# EAGLE design 04B-005 (EAGLE 6.3)
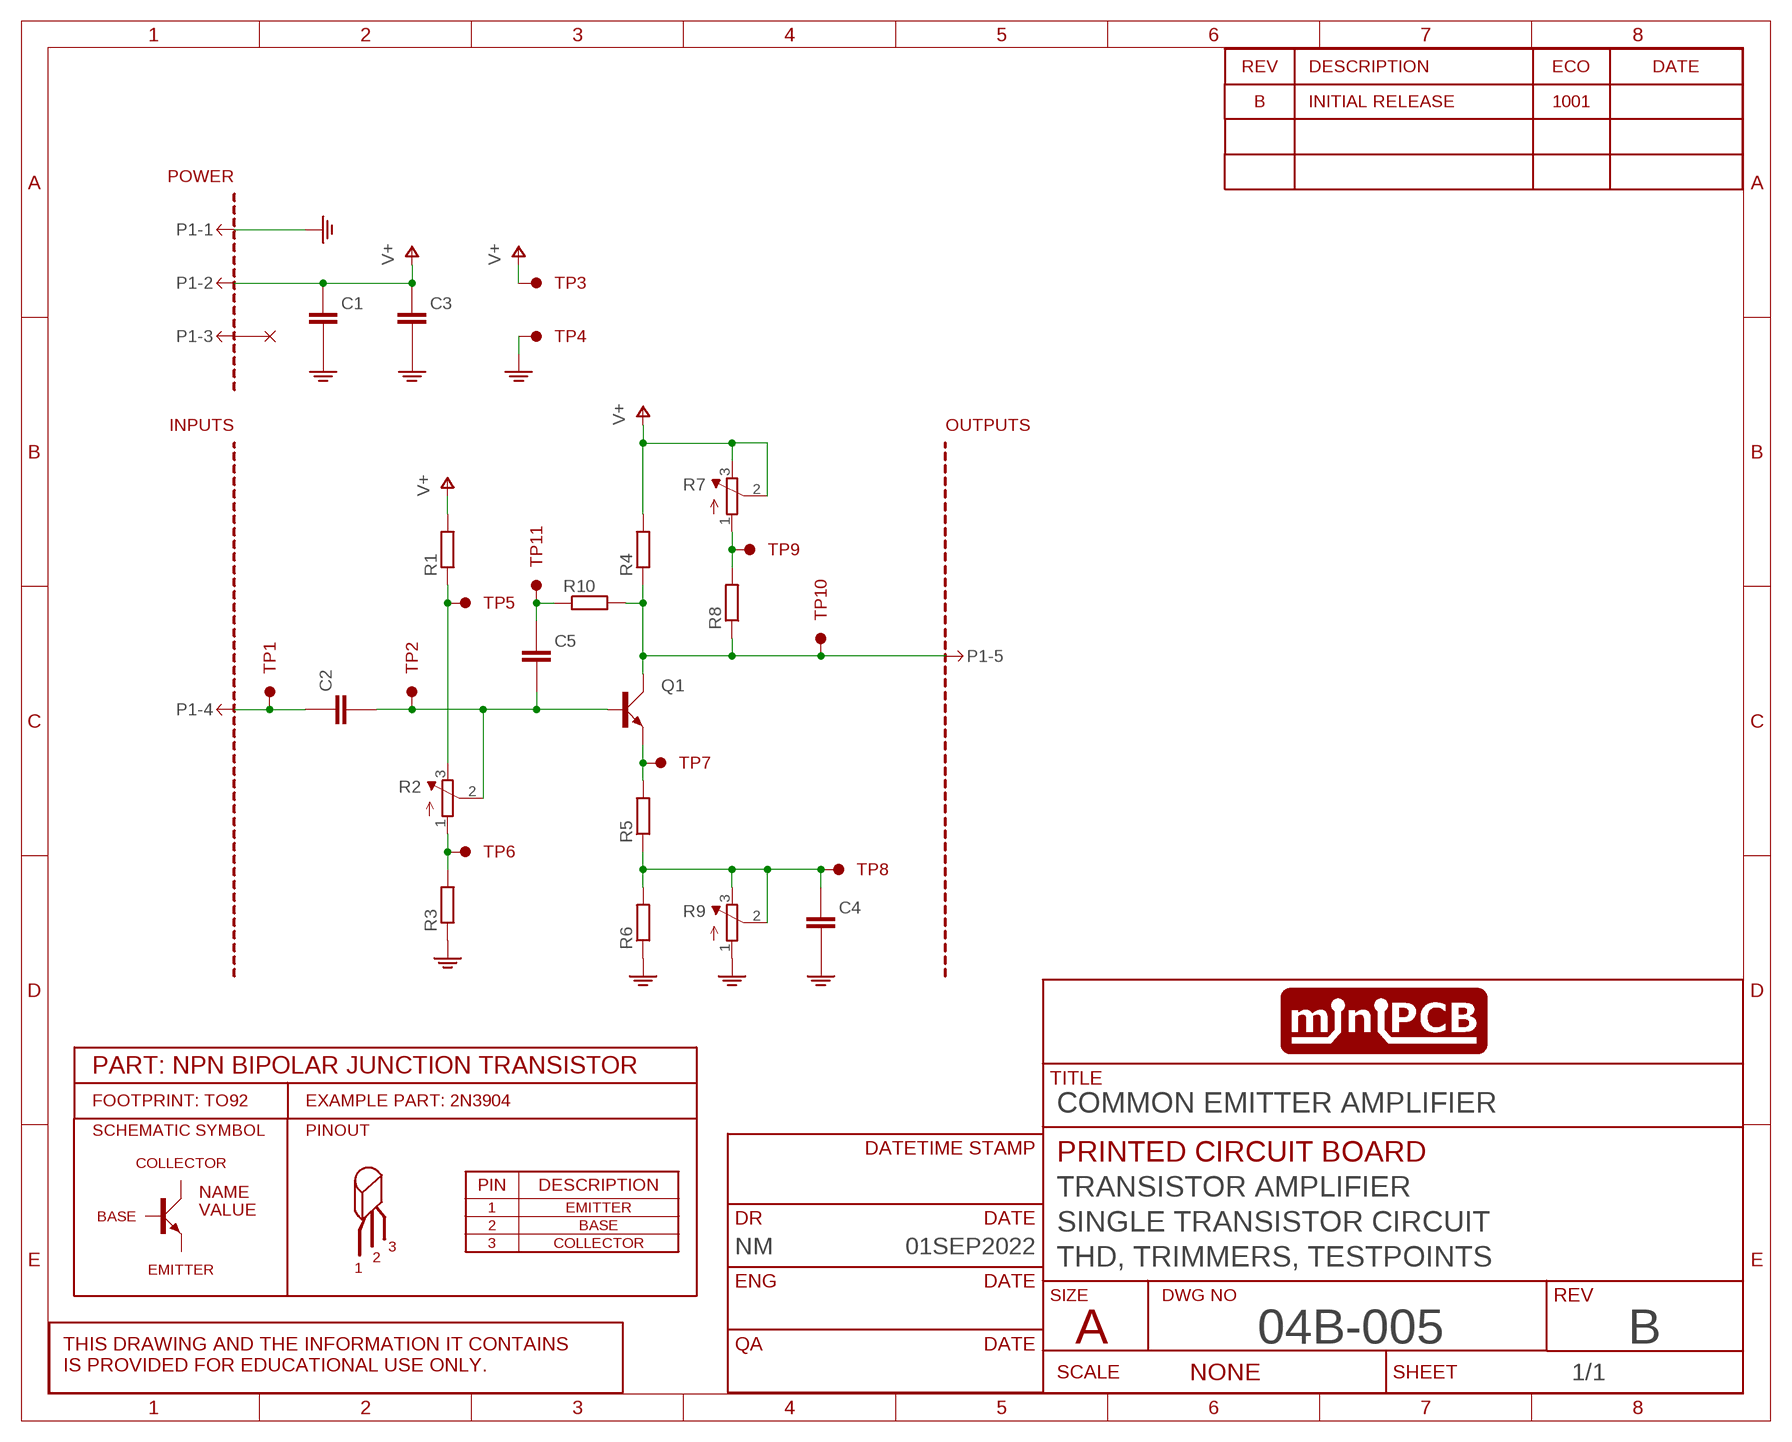
[diagram p0: schematic, sheet 1]
SHEET1 (SCHEMATIC): CIRCUIT_CATEGORY: TRANSISTOR AMPLIFIER; CIRCUIT_NAME: SINGLE TRANSISTOR CIRCUIT; CIRCUIT_VARIANT: THD, TRIMMERS, TESTPOINTS; DR: NM; DR_DATE: 01SEP2022; REVA: B; REVA_ECO: 1001; REVISION: B; TITLE: COMMON EMITTER AMPLIFIER

## Parts
C1  CAPACITORTHD  [C050-024X044]
C2  CAPACITORTHD  [C050-024X044]
C3  CAPACITORTHD  [C050-024X044]
C4  CAPACITORTHD  [C050-024X044]
C5  CAPACITORTHD  [C050-024X044]
P1-  MINIPCB_5P50X50  [MINIPCB_5P_50X50MM]
Q1  BJT_NPNEBC  [TO92-EBC-OVAL]
R1  RESISTOR10MM  [0207/10]
R2  TRIMPOT0.100THD  [TRIM_0100]
R3  RESISTOR10MM  [0207/10]
R4  RESISTOR10MM  [0207/10]
R5  RESISTOR10MM  [0207/10]
R6  RESISTOR10MM  [0207/10]
R7  TRIMPOT0.100THD  [TRIM_0100]
R8  RESISTOR10MM  [0207/10]
R9  TRIMPOT0.100THD  [TRIM_0100]
R10  RESISTOR10MM  [0207/10]
TP1  TESTPOINTKE5000-SMTEXT  [PINS_1_TESTPOINT_KE5000_NOTEXT]
TP2  TESTPOINTKE5000-SMTEXT  [PINS_1_TESTPOINT_KE5000_NOTEXT]
TP3  TESTPOINTKE5000-SMTEXT  [PINS_1_TESTPOINT_KE5000_NOTEXT]
TP4  TESTPOINTKE5000-SMTEXT  [PINS_1_TESTPOINT_KE5000_NOTEXT]
TP5  TESTPOINTKE5000-SMTEXT  [PINS_1_TESTPOINT_KE5000_NOTEXT]
TP6  TESTPOINTKE5000-SMTEXT  [PINS_1_TESTPOINT_KE5000_NOTEXT]
TP7  TESTPOINTKE5000-SMTEXT  [PINS_1_TESTPOINT_KE5000_NOTEXT]
TP8  TESTPOINTKE5000-SMTEXT  [PINS_1_TESTPOINT_KE5000_NOTEXT]
TP9  TESTPOINTKE5000-SMTEXT  [PINS_1_TESTPOINT_KE5000_NOTEXT]
TP10  TESTPOINTKE5000-SMTEXT  [PINS_1_TESTPOINT_KE5000_NOTEXT]
TP11  TESTPOINTKE5000-SMTEXT  [PINS_1_TESTPOINT_KE5000_NOTEXT]

## Nets
GND: C1.2(-) C3.2(-) C4.2(-) P1-.1 R3.1 R6.1 R9.1(A) TP4.1
N$1: R7.1(A) R8.2 TP9.1
N$2: R1.1 R2.3(E) TP5.1
N$3: R2.1(A) R3.2 TP6.1
N$4: C4.1(+) R5.1 R6.2 R9.2(S) R9.3(E) TP8.1
N$5: C2.2(-) C5.2(-) Q1.B R2.2(S) TP2.1
N$6: Q1.E R5.2 TP7.1
N$8: C5.1(+) R10.1 TP11.1
N$9: P1-.5 Q1.C R4.1 R8.1 R10.2 TP10.1
N$10: C2.1(+) P1-.4 TP1.1
V+: C1.1(+) C3.1(+) P1-.2 R1.2 R4.2 R7.2(S) R7.3(E) TP3.1
Unconnected: P1-.3

## Library data of the parts
C1-C5 = minipcb:CAPACITOR
P1- = minipcb:MINIPCB_5P; PART_NUMBER: X04B-005-B; REVISION: A
Q1 = minipcb:BJT_NPN: TRANSISTOR
R1 R3-R6 R8 R10 = minipcb:RESISTOR
R2 R7 R9 = minipcb:TRIMPOT: SMT trimmer potentiometer part number TC33X http://www.ladyada.net/library/eagle
TP1-TP11 = minipcb:TESTPOINT

## Board
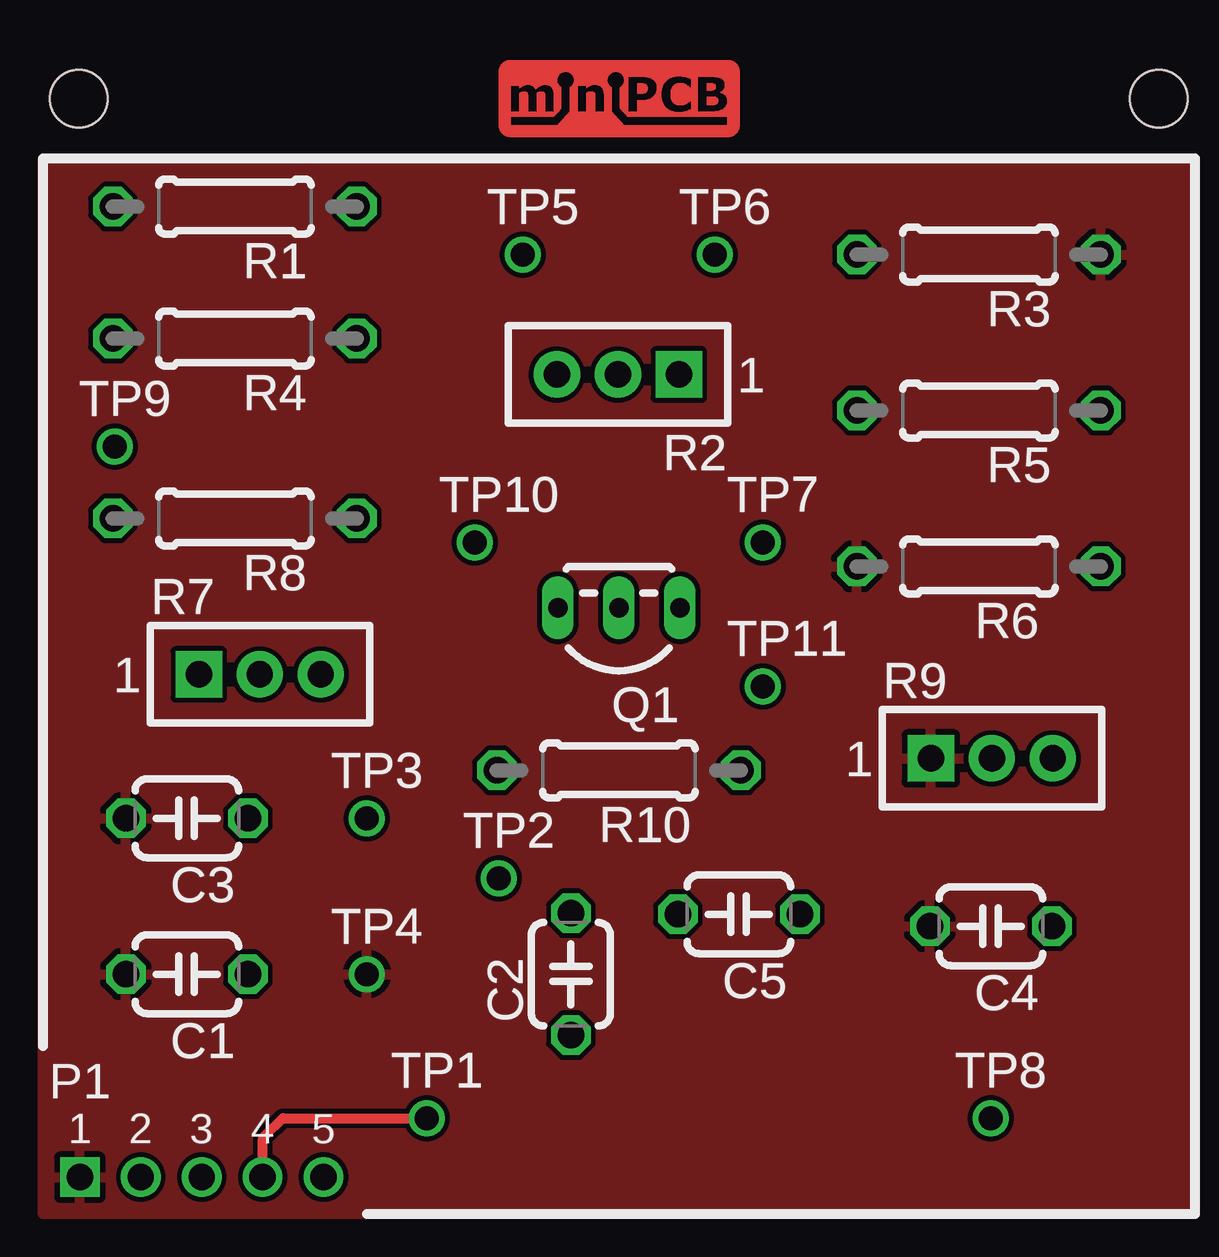
[diagram p1: board, top side]
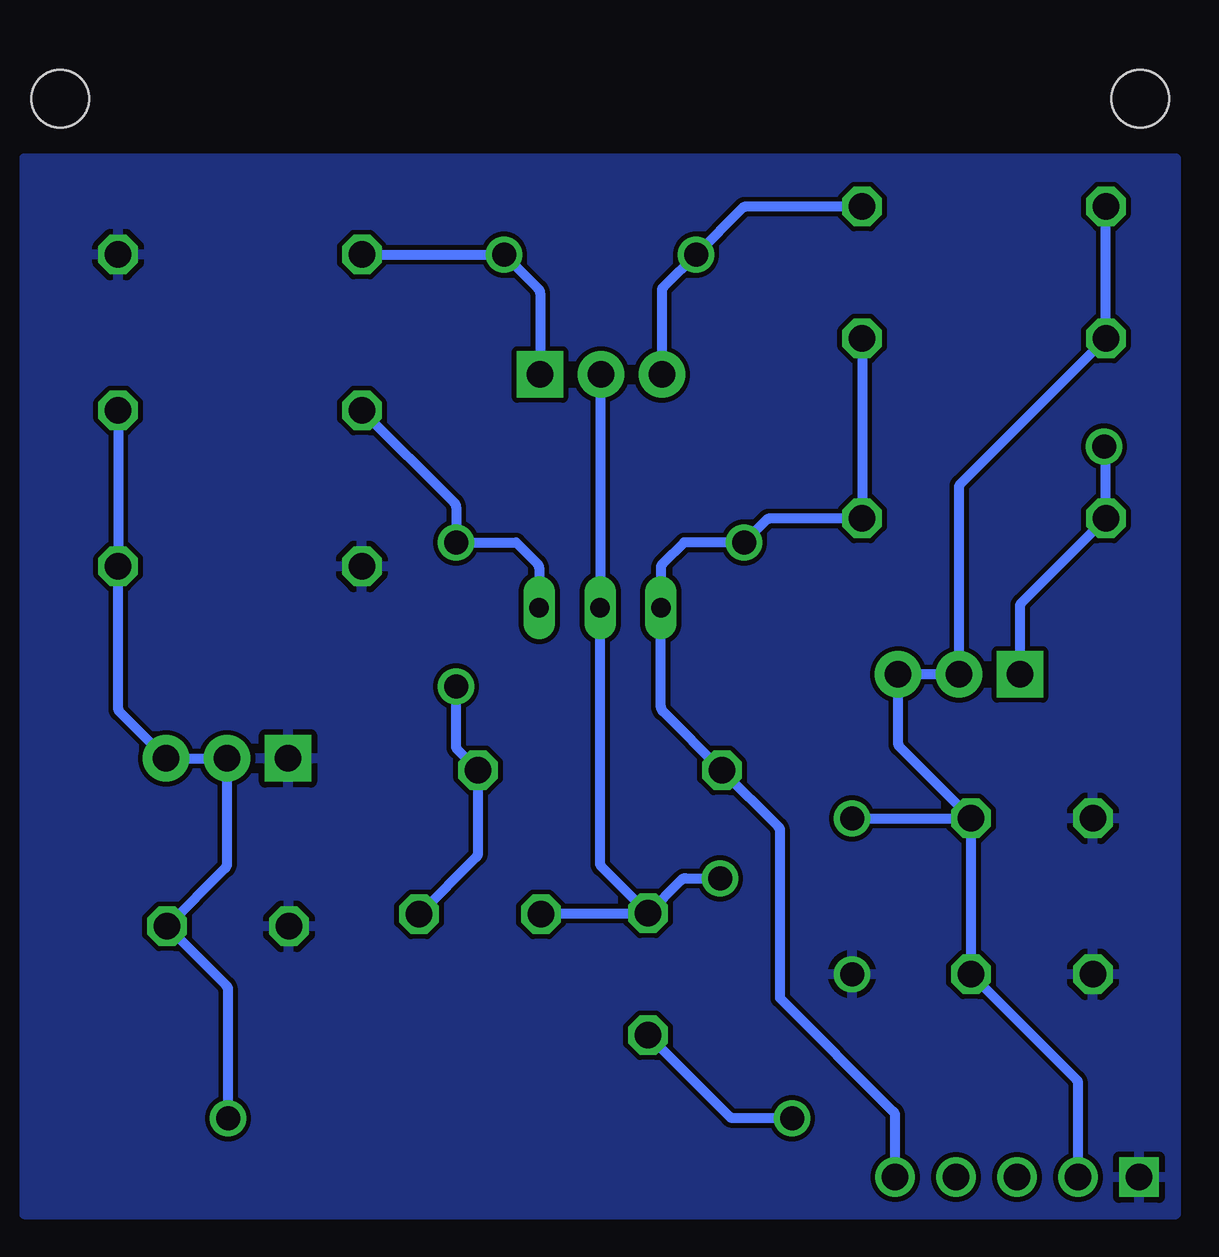
[diagram p2: board, bottom side, seen from below]

No outline drawn. Coordinates in mm, seen from the top.
Copper layers (1*16): Top 0.035mm / dielectric 1.5mm / Bottom 0.035mm
Design rules "minipcb": minimum track width 10mil, minimum drill 24mil, track to track 8mil, track to pad 8mil, pad to pad 8mil, via to via 8mil, smd to smd 8mil, copper to edge 40mil, drill to drill 8mil, minimum pad ring 10mil, minimum via ring 8mil, stop-mask expansion 4mil, vias tented up to drill 20mil, thermal gap 10mil

### Footprints (pad centres in the part's own frame; a part is rotated, then mirrored left to right if it is on the bottom)
C050-024X044 = drill 1.1 octagon: 1 -2.54,0; 2 2.54,0
MINIPCB_5P_50X50MM = drill 1.1 square: 1 2.54,2.54 | drill 1.1: 2 5.08,2.54; 3 7.62,2.54; 4 10.16,2.54; 5 12.7,2.54 | hole 2.4: 47.5,47.5; 2.5,47.5
TO92-EBC-OVAL@1 = drill 0.813 long: B 0,-1.27; C 2.54,-1.27; E -2.54,-1.27
0207/10 = drill 1.1 octagon: 1 -5.08,0; 2 5.08,0
TRIM_0100 = drill 1.1 pad 1.93 square: 1 0,0 | drill 1.1 pad 1.93: 2 2.54,0; 3 5.08,0
PINS_1_TESTPOINT_KE5000_NOTEXT = drill 1: 1 0,0

### Placement (x,y rotation side)
C1  7,11 180 top
C2  23,11 90 top
C3  7,17.5 180 top
C4  40.5,13 180 top
C5  30,13.5 180 top
P1-  0,0 0 top
Q1  [TO92-EBC-OVAL@1]  25,25 180 top
R1  9,43 180 top
R2  27.5,36 180 top
R3  40,41 180 top
R4  9,37.5 180 top
R5  40,34.5 180 top
R6  40,28 0 top
R7  7.5,23.5 0 top
R8  9,30 180 top
R9  38,20 0 top
R10  25,19.5 180 top
TP1  17,5 0 top
TP2  20,15 0 top
TP3  14.5,17.5 0 top
TP4  14.5,11 0 top
TP5  21,41 0 top
TP6  29,41 0 top
TP7  31,29 0 top
TP8  40.5,5 0 top
TP9  4,33 0 top
TP10  19,29 0 top
TP11  31,23 0 top

### Tracks (layer width: path | path; a pad name or v marks a point on that pad's centre or on a via)
GND
  pour Bottom: 1,45 49,45 49,1 1,1
  pour Top: 1,45 49,45 49,1 1,1
N$1
  Bottom 0.406: R7.1 7.5,26.32 arc45 7.43,26.49 R8.2 3.92,32.81 arc-45 TP9.1
N$2
  Bottom 0.406: R1.1 18.89,43 arc-45 19.07,42.93 TP5.1 22.35,39.65 arc-45 22.42,39.48 R2.3
N$3
  Bottom 0.406: R2.1 27.5,39.4 arc-45 27.57,39.57 TP6.1 R3.2
N$4
  Bottom 0.406: TP8.1 40.5,10.36 arc-45 40.57,10.53 C4.1 40.61,15.43 arc-45 40.54,15.61 R9.2 R9.3 45.01,21.93 arc45 45.08,22.11 R6.2 R5.1
N$5
  Bottom 0.406: C2.2 24.93,15.47 arc45 25,15.64 Q1.B 25,35.9 arc45 R2.2 | C2.2 21.61,14.93 arc45 21.43,15 TP2.1 | C5.2 arc45 27.36,13.54 C2.2
N$6
  Bottom 0.406: Q1.E 27.54,27.93 arc-45 27.61,28.11 28.5,29 TP7.1 31,30.48 arc-45 31.07,30.65 R5.2
N$8
  Bottom 0.406: C5.1 30.15,15.89 arc-45 30.08,16.07 R10.1 30.93,20.35 arc45 31,20.52 TP11.1
N$9
  Bottom 0.406: R4.1 R8.1 17.89,30 arc-45 18.07,29.93 TP10.1 21.5,29 22.39,28.11 arc-45 22.46,27.93 Q1.C 22.46,22.14 arc-45 22.39,21.97 R10.2 17.57,17.15 arc45 17.5,16.98 17.5,10 12.77,5.27 arc45 12.7,5.09 P1-.5
N$10
  Top 0.406: P1-.4 10.16,4.05 arc-45 10.23,4.23 11,5 TP1.1
  Bottom 0.406: TP1.1 19.43,5 arc45 19.61,5.07 C2.1
V+
  Bottom 0.406: P1-.2 5.08,6.43 arc-45 5.15,6.61 C1.1 C3.1 | TP3.1 C3.1 | C3.1 12.51,20.47 arc45 12.58,20.64 R7.3 R7.2 10.04,31.27 arc45 9.97,31.45 R4.2 R1.2

### Text on the board
_tNames: TP5 | TP6 | R1 | R3 | R4 | TP9 | R2 | R5 | TP10 | TP7 | R8 | R7 | R6 | TP11 | Q1 | R9 | TP3 | R10 | TP2 | C3 | TP4 | C5 | C4 | C1 | C2 | TP1 | TP8